# EAGLE schematic Buffered mult rev 2 (EAGLE 7.5.0)
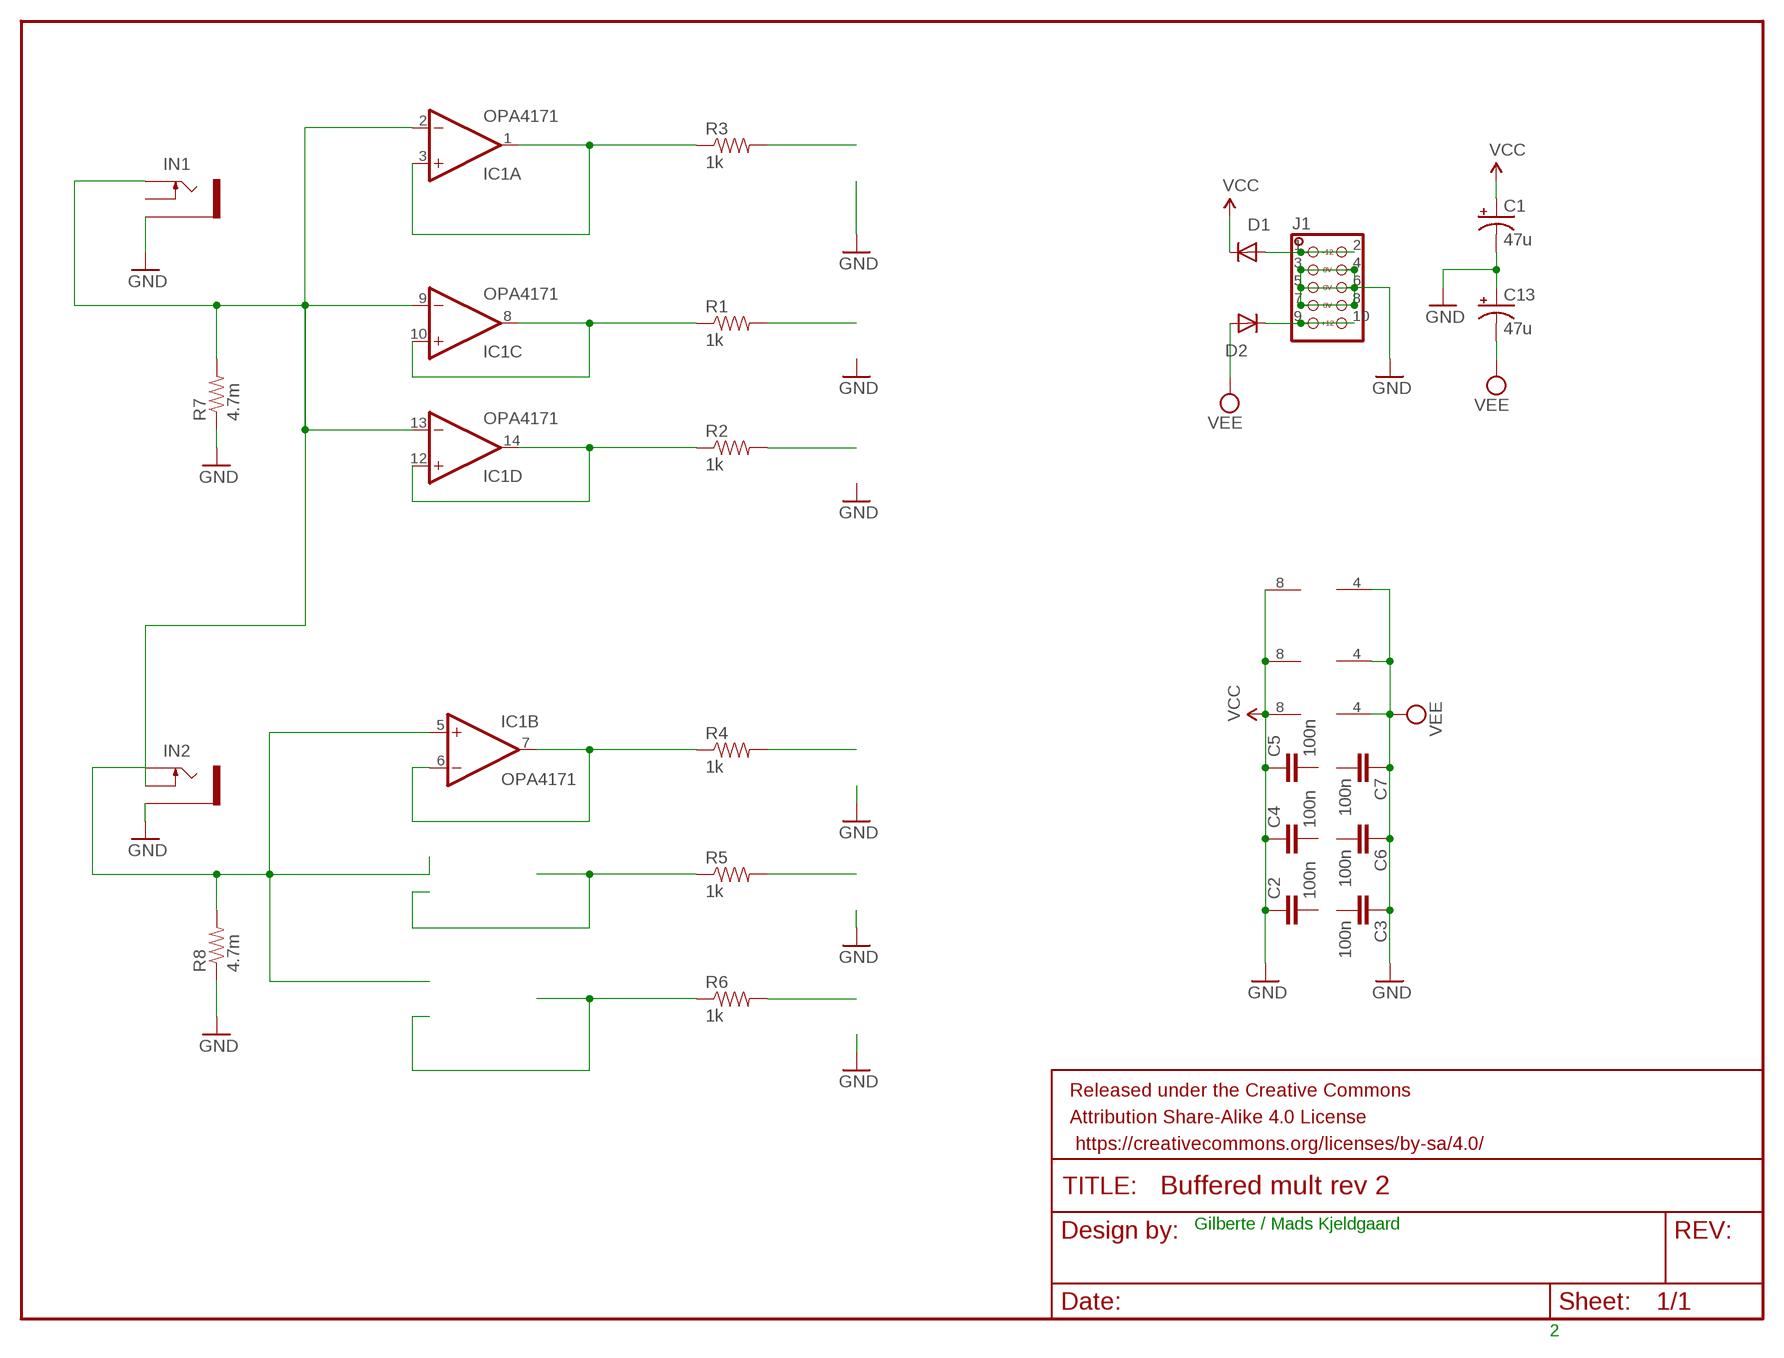
[diagram p0: schematic, sheet 1]

## Parts
C1  47u  CPOL-USD  [PANASONIC_D]
C2  100n  CAP1206  [1206]
C3  100n  CAP1206  [1206]
C4  100n  CAP1206  [1206]
C5  100n  CAP1206  [1206]
C6  100n  CAP1206  [1206]
C7  100n  CAP1206  [1206]
C13  47u  CPOL-USD  [PANASONIC_D]
D1  1N5819HW  DIODE-SOD123  [SOD123]
D2  1N5819HW  DIODE-SOD123  [SOD123]
FRAME1  FRAME-LETTER  [CREATIVE_COMMONS]
IC1  OPA4171  TL074PW  [TSSOP14]
IN1  THONKICONNOLD  [THONKICONN]
IN2  THONKICONNOLD  [THONKICONN]
J1  EUROPWR_2X05-SMD  [2X05_EUROPWR_SMD]
R1  1k  RESISTOR1206  [1206]
R2  1k  RESISTOR1206  [1206]
R3  1k  RESISTOR1206  [1206]
R4  1k  RESISTOR1206  [1206]
R5  1k  RESISTOR1206  [1206]
R6  1k  RESISTOR1206  [1206]
R7  4.7m  RESISTOR1206  [1206]
R8  4.7m  RESISTOR1206  [1206]
U1  TL072_SMD  [SO08]
U2  TL072_SMD  [SO08]
U3  TL072_SMD  [SO08]

## Nets
GND: C1.- C2.1 C3.1 C4.1 C5.1 C6.1 C7.1 C13.+ IN1.P$1_SLEEVE(SLEEVE) IN2.P$1_SLEEVE(SLEEVE) J1.3 J1.4 J1.5 J1.6 J1.7 J1.8 R7.1 R8.1 U1.4(P:V-) U1.8(P:V+) U2.4(P:V-) U2.8(P:V+) U3.4(P:V-) U3.8(P:V+) ; supply symbol labelled VEE, VCC
N$1: R6.2
N$2: IC1.1(A:OUT) IC1.3(A:+IN) R3.1
N$3: R5.2
N$4: R4.2
N$5: IC1.2(A:-IN) IC1.9(C:-IN) IC1.13(D:-IN) IN1.P$3_TIP(TIP) IN2.P$2_SWITCH(SWITCH) R7.2
N$6: IC1.12(D:+IN) IC1.14(D:OUT) R2.1
N$7: R1.2
N$8: R2.2
N$9: R3.2
N$10: IC1.8(C:OUT) IC1.10(C:+IN) R1.1
N$11: IC1.5(B:+IN) IN2.P$3_TIP(TIP) R8.2
N$12: R6.1
N$13: R5.1
N$14: D2.C J1.9 J1.10
N$15: D1.A J1.1 J1.2
N$17: IC1.6(B:-IN) IC1.7(B:OUT) R4.1
VCC: C1.+ D1.C
VEE: C13.- D2.A
Unconnected: C2.2 C3.2 C4.2 C5.2 C6.2 C7.2 IN1.P$2_SWITCH(SWITCH) U1.1(A:OUT) U1.2(A:-IN) U1.3(A:+IN) U1.5(B:+IN) U1.6(B:-IN) U1.7(B:OUT) U2.1(A:OUT) U2.2(A:-IN) U2.3(A:+IN) U2.5(B:+IN) U2.6(B:-IN) U2.7(B:OUT) U3.1(A:OUT) U3.2(A:-IN) U3.3(A:+IN) U3.5(B:+IN) U3.6(B:-IN) U3.7(B:OUT)

## Notes on the sheet
- Gilberte / Mads Kjeldgaard
- 2

## Power pins joined to a net without a drawn wire
V+: IC1.4(P:V+)
V-: IC1.11(P:V-)

## Library data of the parts
C1 C13 = rcl:CPOL-US: POLARIZED CAPACITOR, American symbol
C2-C7 = SparkFun-Capacitors:CAP: Capacitor Standard 0603 ceramic capacitor, and 0.1" leaded capacitor.
D1 D2 = diode:DIODE-: DIODE
FRAME1 = SparkFun-Aesthetics:FRAME-LETTER: Schematic Frame Standard 8.5x11 US Letter frame
IC1 = linear:TL074: OP AMP
IN1 IN2 = MusicThingModular:THONKICONN: 3.5mm socket for Eurorack modular synths
J1 = tsyklon-labs:EUROPWR_2X05: 2x05 pin header
R1-R8 = SparkFun-Passives:RESISTOR: Resistor Basic schematic elements and footprints for 0603, 1206, and PTH resistors.
U1-U3 = MusicThingModular:TL072: Generic Dual Op Amp